# Altium schematic sheet Logger_L072CB_LiPo_Flash_EEprom.SchDoc
size A4
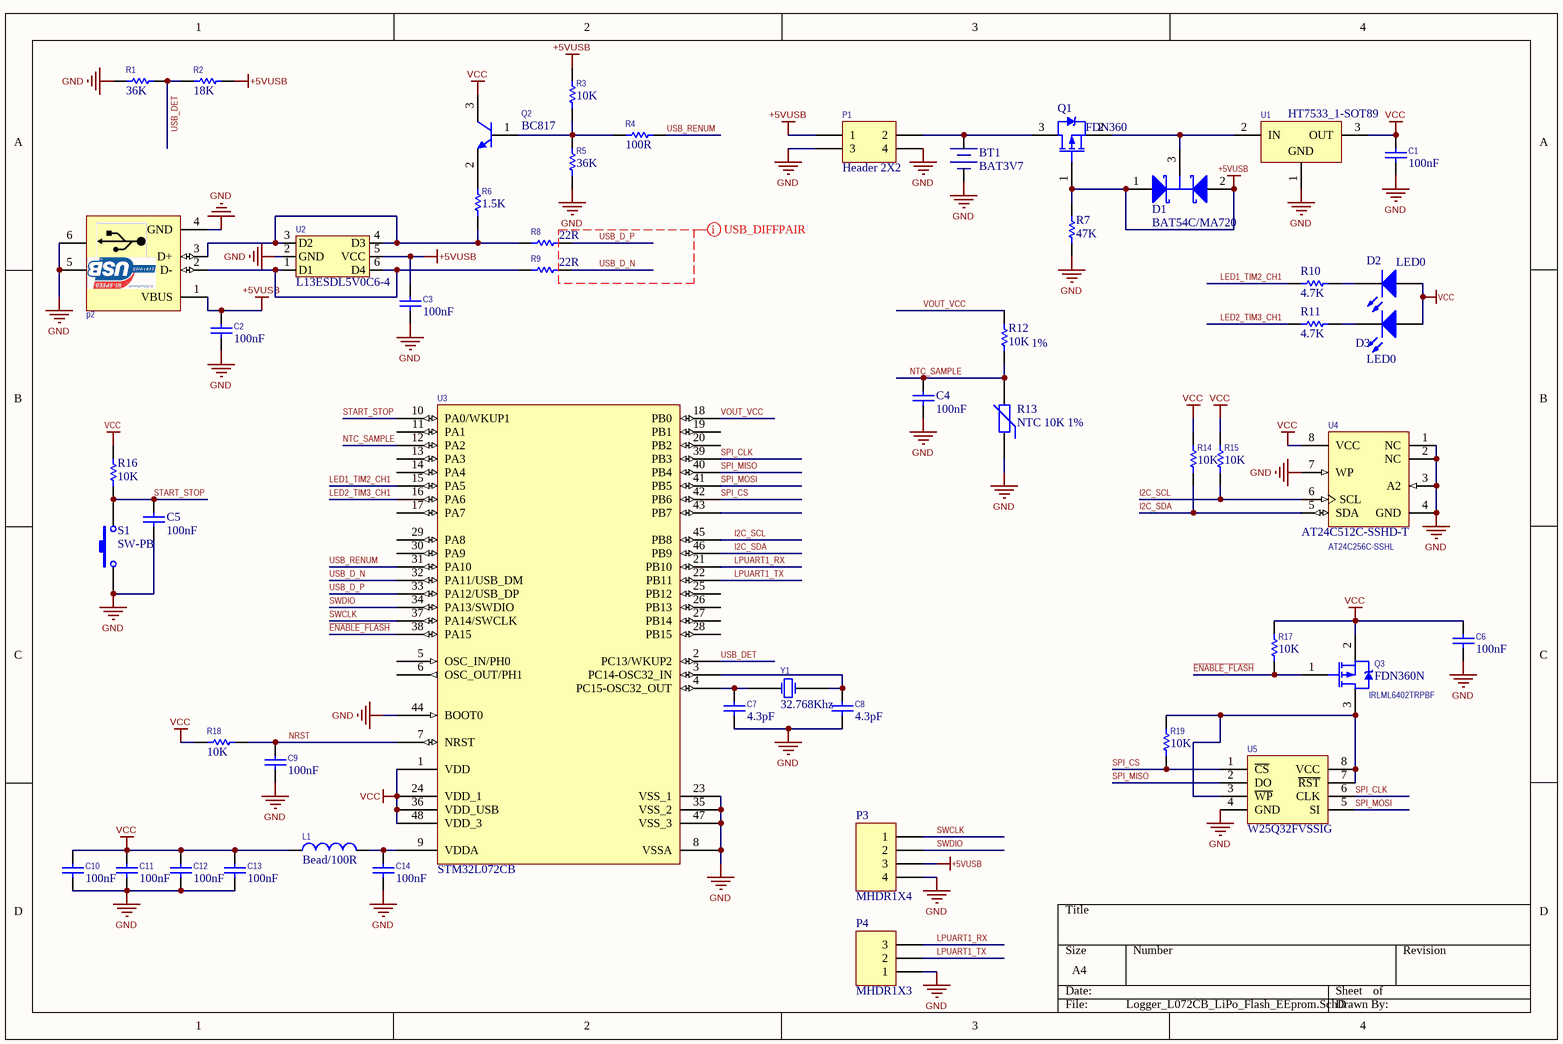
[diagram p0: Logger_L072CB_LiPo_Flash_EEprom.SchDoc]

## Parts
BT1  BAT3V7  [BTH2032-smd]
C1  100nF  [CAP0603]
C2  100nF  [CAP0603]
C3  100nF  [CAP0603]
C4  100nF  [CAP0603]
C5  100nF  [CAP0603]
C6  100nF  [CAP0603]
C7  4.3pF  [CAP0603]
C8  4.3pF  [CAP0603]
C9  100nF  [CAP0603]
C10  100nF  [CAP0603]
C11  100nF  [CAP0603]
C12  100nF  [CAP0603]
C13  100nF  [CAP0603]
C14  100nF  [CAP0603]
D1  BAT54C/MA720  [SOT23_N]
D2  LED0  [LED_0805]
D3  LED0  [LED_0805]
L1  Bead/100R  [IND0805]
P1  Header 2X2  [HDR2X2]
p2  USB Connector  [USB A TYPE Right Angle]  (value not drawn)
P3  MHDR1X4  [HDR1X4]
P4  MHDR1X3  [HDR1X3]
Q1  FDN360  [SOT-23_N]
Q2  BC817  [SOT23_N]
Q3  FDN360N  [Micro3_N]
R1  36K  [RES0603]
R2  18K  [RES0603]
R3  10K  [RES0603]
R4  100R  [RES0603]
R5  36K  [RES0603]
R6  1.5K  [RES0603]
R7  value 47K  [RES0603]  (hidden comment: Res1)
R8  22R  [RES0603]
R9  22R  [RES0603]
R10  value 4.7K  [RES0603]  (hidden comment: Res1)
R11  value 4.7K  [RES0603]  (hidden comment: Res1)
R12  1%  value 10K  [RES0603]
R13  NTC 10K 1%  [CAP_MLCC_RAD_0.1]
R14  10K  [RES0603]
R15  10K  [RES0603]
R16  10K  [RES0603]
R17  10K  [RES0603]
R18  10K  [RES0603]
R19  10K  [RES0603]
S1  SW-PB  [SW-4PIN-SMD]
U1  HT7533_1-SOT89  [SOT89N]
U2  L13ESDL5V0C6-4  [SOT23-6_M]
U3  STM32L072CB  [LQFP48_N]
U4  AT24C512C-SSHD-T  [SO-8N]
U5  W25Q32FVSSIG  [8S2_M]
Y1  32.768Khz  [CM415]

## Nets
+5VUSB: C2.1 C3.2 D1.1(A1) D1.2(A2) P1.1 p2.1(VBUS) P3.3 Q1.1(G) R2.1 R3.1 R7.1 U2.5(VCC)
GND: BT1.2(-) C1.2 C2.2 C3.1 C4.2 C5.1 C6.2 C7.2 C8.2 C9.2 C10.2 C11.2 C12.2 C13.2 C14.2 P1.3 P1.4 p2.4(GND) p2.5(MH) p2.6(MH) P3.4 P4.1 R1.1 R5.1 R7.2 R13.1 S1.1 U1.1(GND) U2.2(GND) U3.8(VSSA) U3.23(VSS_1) U3.35(VSS_2) U3.44(BOOT0) U3.47(VSS_3) U4.1(NC) U4.2(NC) U4.3(A2) U4.4(GND) U4.7(WP) U5.4(GND)
VCC: C1.1 C6.1 C10.1 C11.1 C12.1 C13.1 D2.1(A) D3.1(A) L1.1 Q2.3(C) Q3.2(S) R14.1 R15.1 R16.2 R17.1 R18.2 U1.3(OUT) U3.1(VDD) U3.24(VDD_1) U3.36(VDD_USB) U3.48(VDD_3) U4.8(VCC)
~{ENABLE_FLASH}: Q3.1(G) R17.2 U3.38(PA15)
I2C_SCL: R15.2 U3.45(PB8) U4.6(SCL)
I2C_SDA: R14.2 U3.46(PB9) U4.5(SDA)
LED1_TIM2_CH1: R10.2 U3.15(PA5)
LED2_TIM3_CH1: R11.2 U3.16(PA6)
LPUART1_RX: P4.3 U3.21(PB10)
LPUART1_TX: P4.2 U3.22(PB11)
NRST: C9.1 R18.1 U3.7(NRST)
NTC_SAMPLE: C4.1 R12.2 R13.2 U3.12(PA2)
SPI_CLK: U3.39(PB3) U5.6(CLK)
SPI_CS: R19.2 U3.42(PB6) U5.1(~{CS})
SPI_MISO: U3.40(PB4) U5.2(DO)
SPI_MOSI: U3.41(PB5) U5.5(SI)
START_STOP: C5.2 R16.1 S1.2 U3.10(PA0/WKUP1)
SWCLK: P3.1 U3.37(PA14/SWCLK)
SWDIO: P3.2 U3.34(PA13/SWDIO)
USB_D_N: R9.1 U3.32(PA11/USB_DM)
USB_D_P: R8.1 U3.33(PA12/USB_DP)
USB_DET: R1.2 R2.2 U3.2(PC13/WKUP2)
USB_RENUM: R4.1 U3.31(PA10)
VOUT_VCC: R12.1 U3.18(PB0)
NetBT1_1: BT1.1(+) P1.2 Q1.3(D)
NetC7_1: C7.1 U3.4(PC15-OSC32_OUT) Y1.2(OSC2)
NetC8_1: C8.1 U3.3(PC14-OSC32_IN) Y1.1(OSC1)
NetC14_1: C14.1 L1.2 U3.9(VDDA)
NetD1_3: D1.3(K) Q1.2(S) U1.2(IN)
NetD2_2: D2.2(K) R10.1
NetD3_2: D3.2(K) R11.1
Netp2_2: p2.2(D-) R9.2 U2.1(D1) U2.6(D4)
Netp2_3: p2.3(D+) R6.2 R8.2 U2.3(D2) U2.4(D3)
NetQ2_1: Q2.1(B) R3.2 R4.2 R5.2
NetQ2_2: Q2.2(E) R6.1
NetQ3_3: Q3.3(D) R19.1 U5.3(~{WP}) U5.7(~{RST}) U5.8(VCC)

Not connected (* = marked no-connect by the designer): U3 5(OSC_IN/PH0) 6(OSC_OUT/PH1) 11(PA1) 13(PA3) 14(PA4) 17(PA7) 19(PB1) 20(PB2) 25(PB12) 26(PB13) 27(PB14) 28(PB15) 29(PA8) 30(PA9) 43(PB7)

## Layout directives
differential pair: USB_D_N, USB_D_P

## Notes on the sheet
- (near U4) AT24C256C-SSHL
- (near Q3) IRLML6402TRPBF
- (in symbol USB A CONNECTOR) D:AbbasBasereh

## Library data of the parts
BT1 = Battry Backup: Designer: Abbas Basereh; Data: 16-12-2016; Link: *; Part. No: *
C1-C14 = Cap: Capacitor; Published: 8-Jun-2000; LatestRevisionDate: 17-Jul-2002; LatestRevisionNote: Re-released for DXP Platform.; PackageReference: RAD-0.3; Publisher: Altium Limited; PackageDescription: Radial Cap, Thru-Hole; 2 Leads; 0.3 in Pin Spacing
  C1-C6 C9-C14: Value: 100nF
  C7 C8: Value: 4.3pF
D1 = BAT54C: Schottky Barrier Double Diode; Published: 17-Sep-2003; LatestRevisionDate: 12-Dec-2006; LatestRevisionNote: IPC-7351 Footprint Added.; DatasheetVersion: 4-Mar-2002; PackageVersion: May-1999; PackageReference: SOT23; Publisher: Altium Limited; PackageDescription: 3-Pin SOT-23 Package 0.95 mm Pitch, 2.3 mm Lead Span; ComponentLink1Description: Manufacturer Link; ComponentLink1URL: http://www.semiconductors.philips.com/; ComponentLink2Description: Datasheet; ComponentLink2URL: http://www.semiconductors.philips.com/acrobat/datasheets/BAT54_SERIES_4.pdf
D2 D3 = LED0: Typical INFRARED GaAs LED; Published: 8-Jun-2000; LatestRevisionDate: 08-Jul-2005; LatestRevisionNote: Mech Layer 1 removed.; PackageReference: LED-0; Publisher: Altium Limited; PackageDescription: LED; 2 Leads
L1 = Inductor: Code_IEC: 1005; Published: 8-Jun-2000; LatestRevisionDate: 29-May-2009; LatestRevisionNote: IPC-7351 Footprint Added.; PackageReference: 0402-A; Publisher: Altium Limited; PackageDescription: Chip Inductor; Code_JEITA: 0402; Value: Bead/100R
P1 = Header 2X2: Header, 2-Pin, Dual row; LatestRevisionDate: 17-Jul-2002; LatestRevisionNote: Re-released for DXP Platform.; Publisher: Altium Limited
p2 = USB A CONNECTOR: USB Connector-A Type; Designer: ABBAS BASEREH; Max Current: 600mA; Mounting Technology: Surface Mount\Through-Hole; Category: Connector; Pin Count: 4-6; Publisher: ABBAS BASEREH; Status: Unreleased; ComponentLink1Description: Datasheet; ComponentLink2Description: Reference; Update: 1395-11-17
P3 = MHDR1X4: Header, 4-Pin; LatestRevisionDate: 17-Jul-2002; LatestRevisionNote: Re-released for DXP Platform.; Publisher: Altium Limited
P4 = MHDR1X3: Header, 3-Pin; LatestRevisionDate: 17-Jul-2002; LatestRevisionNote: Re-released for DXP Platform.; Publisher: Altium Limited
Q1 = IRLML5103: HEXFET Power MOSFET; Published: 8-Jun-2000; LatestRevisionDate: 20-Nov-2009; LatestRevisionNote: IPC-7351 Footprint Added.; DatasheetVersion: Aug-1997; PackageReference: SOT-23; Publisher: Altium Limited; PackageDescription: 3-Pin SOT-23 Package 0.95 mm Pitch, 2.3 mm Lead Span; ComponentLink1Description: Manufacturer Link; ComponentLink1URL: http://www.irf.com/; ComponentLink2Description: Datasheet; ComponentLink2URL: http://www.irf.com/product-info/datasheets/data/irlml5103.pdf
Q2 = BC817: 45 V, 500 mA NPN general-purpose transistors; Published: 2017-2-8; LatestRevisionDate: 2017; LatestRevisionNote: IPC-7351 Footprint Added.; DatasheetVersion: 2017; PackageVersion: 2017-2-8; PackageReference: SOT23; Publisher: Abbas Basereh; PackageDescription: 3-Pin SOT-23 Package 0.95 mm Pitch, 2.3 mm Lead Span; ComponentLink1Description: Manufacturer Link; ComponentLink1URL: http://www.nxp.com/; ComponentLink2Description: Datasheet; ComponentLink2URL: http://www.nxp.com/
Q3 = IRLML6401: HEXFET Power MOSFET; Published: 17-Sep-2003; DatasheetVersion: 2-Jul-2001; PackageVersion: Jul-2001; PackageReference: Micro3; Publisher: Altium Limited; PackageDescription: 3-Pin SOT-23 Package 0.95 mm Pitch, 2.3 mm Lead Span; ComponentLink1Description: Manufacturer Link; ComponentLink1URL: http://www.irf.com/; ComponentLink2Description: Datasheet; ComponentLink2URL: http://www.irf.com/product-info/datasheets/data/IRLML6401.pdf
R1-R12 R14-R19 = Res1: Resistor; Published: 8-Jun-2000; LatestRevisionDate: 17-Jul-2002; LatestRevisionNote: Re-released for DXP Platform.; PackageReference: AXIAL-0.3; Publisher: Altium Limited; PackageDescription: Axial Device, Thru-Hole; 2 Leads; 0.3 in Pin Spacing
  R1 R5: Value: 36K
  R2: Value: 18K
  R3 R14-R19: Value: 10K
  R4: Value: 100R
  R6: Value: 1.5K
  R8 R9: Value: 22R
R13 = Res Varistor: Varistor (Voltage-Sensitive Resistor); Published: 24-Mar-1999; LatestRevisionDate: 29-May-2009; LatestRevisionNote: IPC-7351 Footprint Added.; PackageVersion: Mar-2003; PackageReference: 6-0805; Publisher: Altium Limited; PackageDescription: Chip Resistor 0805 Case Size; Code_IPC: RESC2012
S1 = SW-PB: Switch; Published: 24-Mar-1999; LatestRevisionDate: 17-Jul-2002; LatestRevisionNote: Re-released for DXP Platform.; PackageReference: SPST-2; Publisher: Altium Limited; PackageDescription: Switch; 2 Leads
U1 = HT7533_1-SOT89: 100mA Low Power LDO, Output Voltage 3.3V, SOT89 Pkg; DatasheetVersion: Rev1.80, Mar-2010; PackageVersion: 25/05/2010; PackageReference: SOT89; PackageDescription: 3-Pin SOT-89 Package 1.5 mm Pitch, 4.1 mm Lead Span; Code_IPC: SOT89; ComponentLink1Description: Manufacturer URL; ComponentLink1URL: http://www.holtek.com/; ComponentLink2Description: Datasheet; ComponentLink2URL: http://www.holtek.com/pdf/consumer/75xx_1v180.pdf; ComponentLink3Description: Package Specification; ComponentLink3URL: http://www.holtek.com/english/literature/package.pdf
U2 = USBUFxxW6: ESD PROTECTION DEVICE
U3 = STM32F103C8T6: STM32 ARM-based 32-bit MCU with 64 Kbytes Flash, 48-pin LQFP, Industrial Temperature; Published: 30-May-2008; DatasheetVersion: rev6, Mar-2008; PackageVersion: Mar-2008; PackageReference: LQFP48; Publisher: Altium Limited; PackageDescription: 48-Pin Low-Profile Quad Flat Pack, 7 x 7 mm Body, 0.5 mm Pitch (LQFP48); ComponentLink1Description: Manufacturer Link; ComponentLink1URL: www.st.com/stm32; ComponentLink2Description: Datasheet; ComponentLink2URL: http://www.st.com/stonline/products/literature/ds/13587.pdf
U4 = AT24C08BN-SP25-B: I2C-Compatible (2-wire) Serial EEPROM / 512-Kbit (65,536 x 8); Published: 20-Sep-2010; DatasheetVersion: 8517C,  Jan-2009; PackageVersion: revC, Mar-2005; PackageReference: 8S1; Publisher: Altium Limited; PackageDescription: 8-Lead (0.150" Wide Body), Plastic Gull Wing Small Outline (JEDEC SOIC); Code_JEDEC: MS-012-AA; Code_IPC: SOIC127P600-8; ComponentLink1Description: Manufacturer Link; ComponentLink1URL: http://www.atmel.com/products/serial/default.asp; ComponentLink2Description: Datasheet; ComponentLink2URL: http://www.atmel.com/dyn/resources/prod_documents/doc8517.pdf; ComponentLink3Description: Atmel.com Home; ComponentLink3URL: http://www.atmel.com
U5 = W25Q: SERIAL FLASH MEMORY WITH DUAL, QUAD SPI
Y1 = XTAL_Crystal: XTAL Crystal; Designer: ABBAS BASEREH; Design Date: 2017-1-3; ComponentLink1Description: Datasheet; ComponentLink2Description: Reference; Mounting Technology: Surface Mount\Through-Hole; Value: 32.768Khz; Status: Unreleased